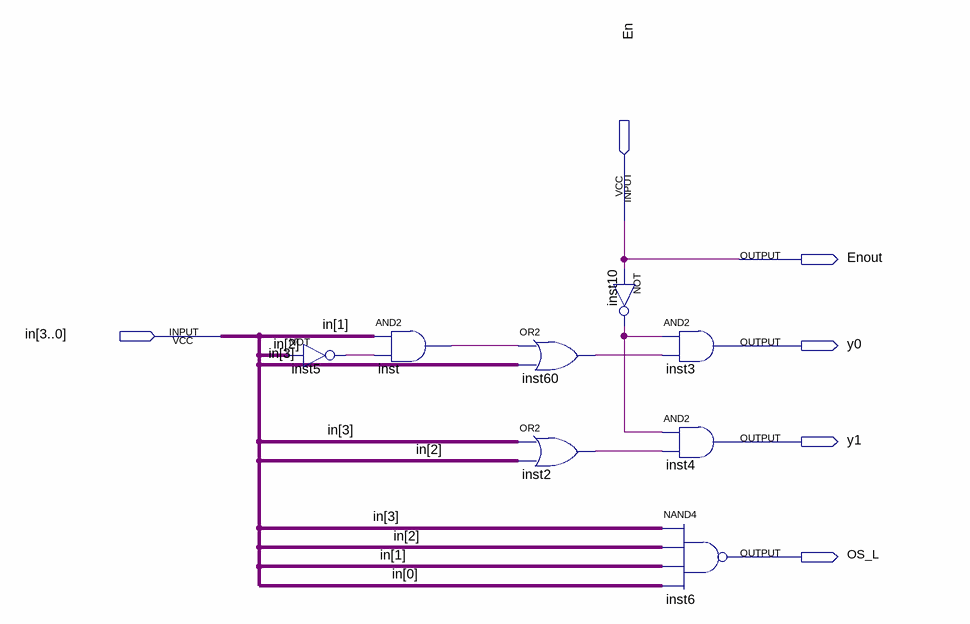
[diagram p0: schematic sheet]
// Quartus schematic PEnc8_3.bdf as structural Verilog: 8 symbols, 6 pins
module PEnc8_3 (
  input  En,
  input  [3:0] in,
  output Enout,
  output y0,
  output y1,
  output OS_L
);

  wire inst2_out, inst5_out, inst10_out, inst60_out, inst_out;

  not inst5 (inst5_out, in[2]);
  and inst (inst_out, in[1], inst5_out);
  or inst60 (inst60_out, inst_out, in[3]);
  or inst2 (inst2_out, in[3], in[2]);
  not inst10 (inst10_out, En);
  and inst3 (y0, inst10_out, inst60_out);
  and inst4 (y1, inst10_out, inst2_out);
  nand inst6 (OS_L, in[3], in[2], in[1], in[0]);

  assign Enout = En;
endmodule
